# Altium schematic sheet 相敏检波器.SchDoc
size A4
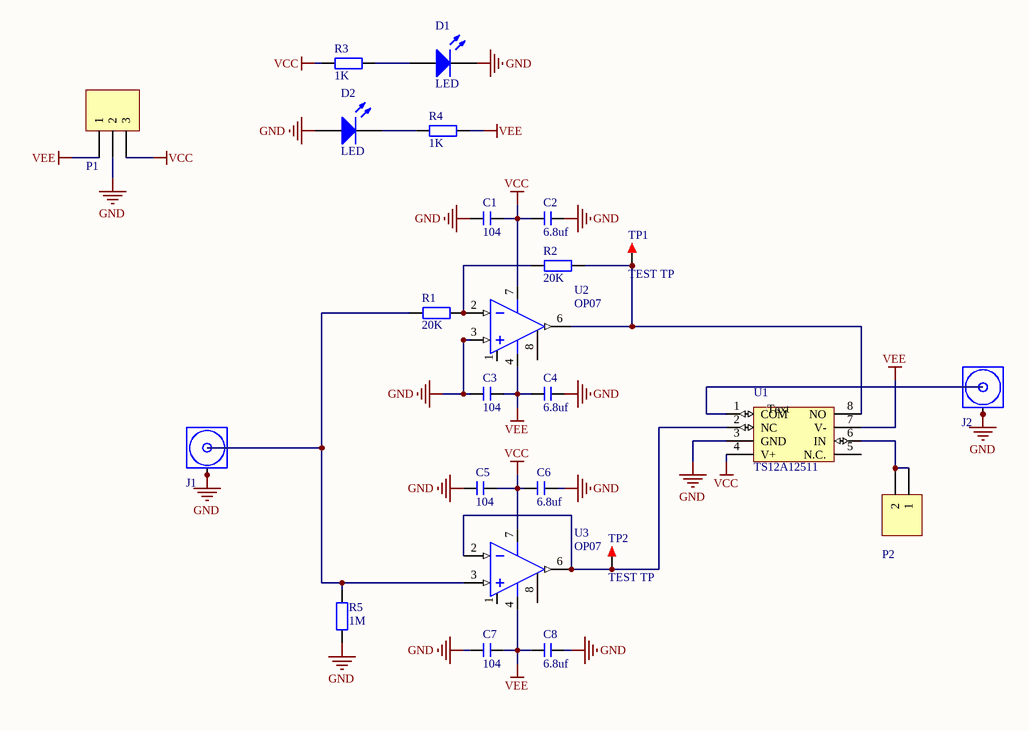
[diagram p0: 相敏检波器.SchDoc]

## Parts
C1  104  [C 0805]
C2  6.8uf  [C 0805]
C3  104  [C 0805]
C4  6.8uf  [C 0805]
C5  104  [C 0805]
C6  6.8uf  [C 0805]
C7  104  [C 0805]
C8  6.8uf  [C 0805]
D1  LED  [LED_0805]
D2  LED  [LED_0805]
J1  COAX  [MCX5.08-5-H]  (value not drawn)
J2  COAX  [MCX5.08-5-H]  (value not drawn)
P1  Header 3  [HDR3X1_B2]  (value not drawn)
P2  Header 2  [HDR2X1_B2]  (value not drawn)
R1  20K  [R 0805]
R2  20K  [R 0805]
R3  1K  [R 0805]
R4  1K  [R 0805]
R5  1M  [R 0805]
TP1  TEST TP  [TEST TP1.4_B]
TP2  TEST TP  [TEST TP1.4_B]
U1  TS12A12511  [SOT23-8N]
U2  OP07  [SO8_L]
U3  OP07  [SO8_L]

## Nets
GND: C1.1 C2.2 C3.1 C4.2 C5.1 C6.2 C7.1 C8.2 D1.2(K) D2.1(A) J1.2(GND) J1.3(GND) J1.4(GND) J1.5(GND) J2.2(GND) J2.3(GND) J2.4(GND) J2.5(GND) P1.2 R5.1 U1.3(GND) U2.3(IN+)
VCC: C1.2 C2.1 C5.2 C6.1 P1.3 R3.1 U1.4(V+) U2.7(V+) U3.7(V+)
VEE: C3.2 C4.1 C7.2 C8.1 P1.1 R4.2 U1.7(V-) U2.4(V-) U3.4(V-)
NetD1_1: D1.1(A) R3.2
NetD2_2: D2.2(K) R4.1
NetJ1_1: J1.1(Signal) R1.1 R5.2 U3.3(IN+)
NetJ2_1: J2.1(Signal) U1.1(COM)
NetP2_1: P2.1 P2.2 U1.6(IN)
NetR1_2: R1.2 R2.1 U2.2(IN-)
NetR2_2: R2.2 TP1.1 U1.8(NO) U2.6(OUT)
NetTP2_1: TP2.1 U1.2(NC) U3.2(IN-) U3.6(OUT)

Not connected (* = marked no-connect by the designer): U1 5(N.C.); U2 1(OFFSET_N1) 8(OFFSET_N2); U3 1(OFFSET_N1) 8(OFFSET_N2)

## Notes on the sheet
- (in symbol TS12A12511) Text

## Library data of the parts
C1-C8 = C: 无极性贴片电容; 版权归属: 源创客; BOM名称: 无极性贴片电容; 学习资源: www.ooocke.com
D1 D2 = LED: 发光二极管; Published: 8-Jun-2000; LatestRevisionDate: 08-Jul-2005; LatestRevisionNote: Mech Layer 1 removed.; PackageReference: LED; Publisher: Altium Limited
P1 = Header 3: 接插件; LatestRevisionDate: 17-Jul-2002; LatestRevisionNote: Re-released for DXP Platform.; Publisher: Altium Limited
P2 = Header 2: 接插件; LatestRevisionDate: 17-Jul-2002; LatestRevisionNote: Re-released for DXP Platform.; Publisher: Altium Limited
R1-R5 = R: 贴片电阻; 版权归属: 源创客; BOM名称: 贴片电阻; 学习资源: www.ooocke.com
TP1 TP2 = TEST TP: 测试环; 版权归属: 源创客; BOM名称: 测试环; 学习资源: www.ooocke.com
U1 = TS12A12511: 具有负信号功能的 5Ω 单通道 SPDT 开关
U2 U3 = OP07: Precision Operational Amplifiers